# EAGLE schematic lasersupply8bit (EAGLE 5.09)
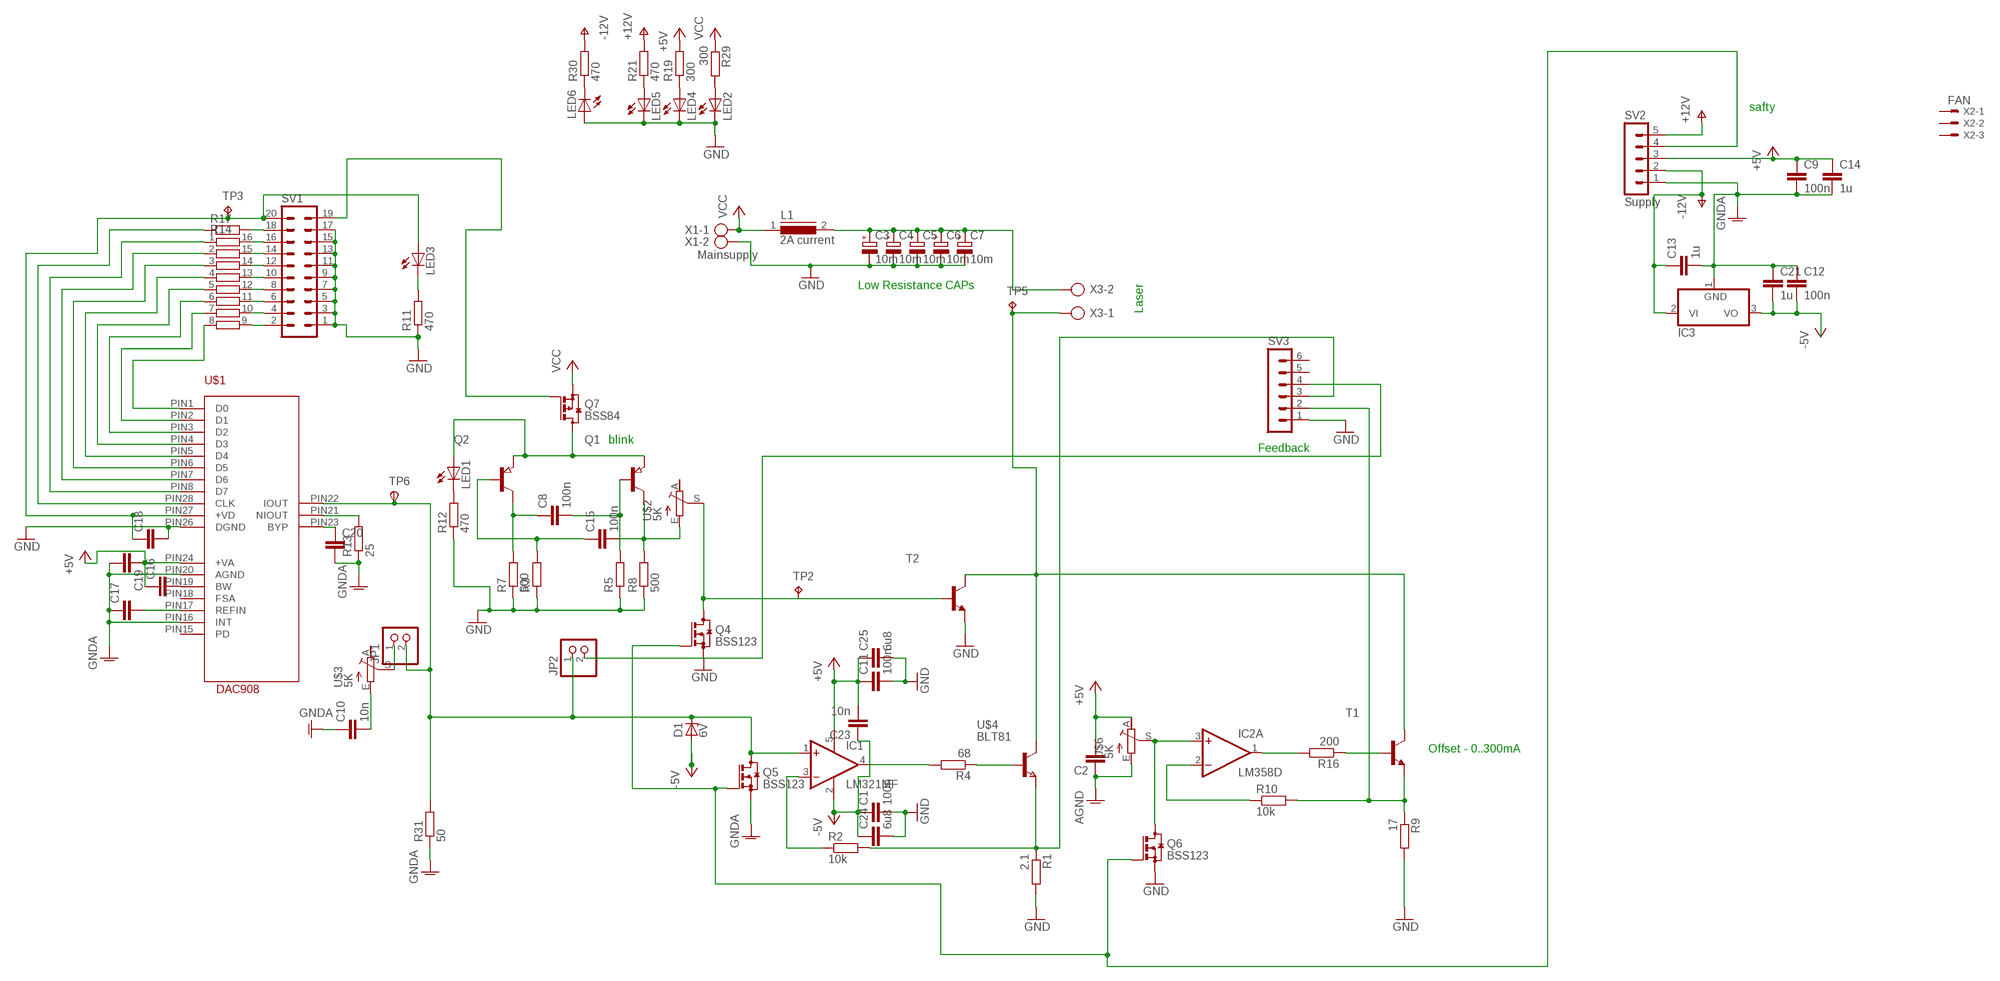
[diagram p0: schematic, sheet 1]

## Parts
C1  100n  C-EUC0805  [C0805]
C2  C-EUC0805  [C0805]
C3  10m  CPOL-EUE7.5-18  [E7,5-18]
C4  10m  CPOL-EUE7.5-18  [E7,5-18]
C5  10m  CPOL-EUE7.5-18  [E7,5-18]
C6  10m  CPOL-EUE7.5-18  [E7,5-18]
C7  10m  CPOL-EUE7.5-18  [E7,5-18]
C8  100n  C-EUC0805  [C0805]
C9  100n  C-EUC0805  [C0805]
C10  10n  C-EUC0805  [C0805]
C11  100n  C-EUC0805  [C0805]
C12  100n  C-EUC0805  [C0805]
C13  1u  C-EUC0805  [C0805]
C14  1u  C-EUC1812  [C1812]
C15  100n  C-EUC0805  [C0805]
C16  C-EUC0805  [C0805]
C17  C-EUC0805  [C0805]
C18  C-EUC0805  [C0805]
C19  C-EUC0805  [C0805]
C20  C-EUC0805  [C0805]
C21  1u  C-EUC1812  [C1812]
C23  10n  C-EUC0805  [C0805]
C24  6u8  C-EUC0805  [C0805]
C25  6u8  C-EUC0805  [C0805]
D1  6V  ZENER-DIODESMB  [SMB]
IC1  LM321MF  [SOT23-5]
IC2  LM358D  [SO08]
IC3  7905T  [TO220H]
JP1  PINHD-1X2  [1X02]
JP2  PINHD-1X2  [1X02]
L1  2A current  82114R  [82114R]
LED1  LEDCHIPLED_1206  [CHIPLED_1206]
LED2  LEDCHIPLED_1206  [CHIPLED_1206]
LED3  LEDCHIPLED_1206  [CHIPLED_1206]
LED4  LEDCHIPLED_1206  [CHIPLED_1206]
LED5  LEDCHIPLED_1206  [CHIPLED_1206]
LED6  LEDCHIPLED_1206  [CHIPLED_1206]
Q1  PNP-TRANSISTOR_SOT23  [SOT23]
Q2  PNP-TRANSISTOR_SOT23  [SOT23]
Q4  BSS123  [SOT23]
Q5  BSS123  [SOT23]
Q6  BSS123  [SOT23]
Q7  BSS84  [SOT23]
R1  2.1  R-EU_M1206  [M1206]
R2  10k  R-EU_M0805  [M0805]
R3  R-EU_M0805  [M0805]
R4  68  R-EU_M0805  [M0805]
R5  R-EU_M0805  [M0805]
R7  500  R-EU_M0805  [M0805]
R8  500  R-EU_M0805  [M0805]
R9  17  R-EU_M1206  [M1206]
R10  10k  R-EU_M0805  [M0805]
R11  470  R-EU_M0805  [M0805]
R12  470  R-EU_M0805  [M0805]
R13  25  R-EU_M0805  [M0805]
R14  2NBS16-8  [SO16]
R16  200  R-EU_M0805  [M0805]
R17  R-EU_M0805  [M0805]
R19  300  R-EU_M0805  [M0805]
R21  470  R-EU_M0805  [M0805]
R29  300  R-EU_M0805  [M0805]
R30  470  R-EU_M0805  [M0805]
R31  50  R-EU_M0805  [M0805]
SV1  ML20  [ML20]
SV2  Supply  MA05-1  [MA05-1]
SV3  MA06-1  [MA06-1]
T1  BC868-NPN-SOT89-BCE  [SOT89-BCE]
T2  BC868-NPN-SOT89-BCE  [SOT89-BCE]
TP2  TPPAD1-13  [P1-13]
TP3  TPPAD1-13  [P1-13]
TP5  TPPAD1-13  [P1-13]
TP6  TPSPAD1-13  [P1-13]
U$1  DAC908  [TSSOP-28]
U$2  5K  TRIMMER  [TRIMMER_SMD]
U$3  5K  TRIMMER  [TRIMMER_SMD]
U$4  BLT81  NXPNPNSOT223  [SOT223]
U$6  5K  TRIMMER  [TRIMMER_SMD]
X1  Mainsupply  AK500/2-H  [AK500/2-H]
X2  FAN  KK-156-3  [KK-156-3]
X3  AK500/2-H  [AK500/2-H]

## Nets
+5V: C2.2 C9.1 C11.1 C14.1 C16.1 C19.1 C23.2 C25.1 IC1.5(V+) R19.2 SV2.3 U$1.PIN24(+VA) U$6.A
-5V: C1.1 C23.1 C24.1 D1.A IC1.2(V-)
B$1: R14.8 U$1.PIN1(D0)
GND: C1.2 C3.- C4.- C5.- C6.- C7.- C11.2 C18.2 C24.2 C25.2 LED2.C LED4.C LED5.C LED6.A Q4.2(S) Q6.2(S) R1.2 R3.1 R5.1 R7.1 R8.1 R9.2 R11.1 R12.1 SV1.1 SV1.3 SV1.5 SV1.7 SV1.9 SV1.11 SV1.13 SV1.15 SV1.17 SV3.1 T2.E U$1.PIN26(DGND) X1.2
GNDA: C9.2 C10.1 C12.1 C13.2 C14.2 C17.1 C19.2 C20.2 C21.1 IC3.1(GND) Q5.2(S) R13.1 R31.1 SV2.1 U$1.PIN16(INT) U$1.PIN20(AGND)
N$1: R1.1 R2.2 SV3.3 U$4.1(E)
N$2: JP2.2 SV3.4
N$3: IC1.3(-IN) R2.1
N$4: IC1.4(OUT) R4.2
N$5: R4.1 U$4.2(B)
N$7: IC2.2(A:-IN) R10.1
N$8: LED1.A Q1.2(E) Q2.2(E) Q7.3(D)
N$9: C8.1 Q2.3(C) R7.2
N$10: D1.C IC1.1(+IN) JP1.2 JP2.1 Q5.3(D) R31.2 TP6.TP(PP) U$1.PIN22(IOUT)
N$11: IC2.1(A:OUT) R16.2
N$12: R16.1 T1.B
N$13: R9.1 R10.2 SV3.2 T1.E
N$14: IC2.3(A:+IN) Q6.3(D) U$6.S
N$17: C12.2 C21.2 IC3.3(VO)
N$19: C8.2 Q1.1(B) R5.2
N$20: T1.C T2.C TP5.TP U$4.4(C) X3.1
N$21: Q4.3(D) T2.B TP2.TP U$2.S
N$23: C15.1 Q2.1(B) R3.2
N$24: Q7.1(G) SV1.19
N$25: R14.7 U$1.PIN2(D1)
N$27: C2.1 U$6.E ; supply symbol labelled AGND
N$29: R14.6 U$1.PIN3(D2)
N$31: C15.2 Q1.3(C) R8.2 U$2.E
N$32: R14.5 U$1.PIN4(D3)
N$33: LED3.C R11.2
N$34: C3.+ C4.+ C5.+ C6.+ C7.+ L1.2 X3.2
N$35: R14.4 U$1.PIN5(D4)
N$36: R14.3 U$1.PIN6(D5)
N$37: R14.2 U$1.PIN7(D6)
N$38: R14.1 U$1.PIN8(D7)
N$39: R17.1 U$1.PIN28(CLK)
N$40: C16.2 U$1.PIN19(BW)
N$41: R14.9 SV1.2
N$42: LED2.A R29.2
N$43: C17.2 U$1.PIN17(REFIN)
N$47: R13.2 U$1.PIN21(NIOUT)
N$48: C20.1 U$1.PIN23(BYP)
N$49: R14.10 SV1.4
N$52: R14.11 SV1.6
N$53: R14.12 SV1.8
N$54: R14.13 SV1.10
N$56: R14.14 SV1.12
N$57: R14.15 SV1.14
N$59: R14.16 SV1.16
N$61: R17.2 SV1.18
N$62: JP1.1 U$3.S
N$63: C10.2 U$3.E
N$64: LED4.A R19.1
N$66: LED5.A R21.1
N$67: LED6.C R30.1
N$68: Q4.1(G) Q5.1(G) Q6.1(G) SV2.4
N$69: LED1.C R12.2
N$70: C18.1 LED3.A SV1.20 TP3.TP U$1.PIN27(+VD)
N$72: L1.1 X1.1 ; supply symbol labelled VCC
V+: R21.2 SV2.5 ; supply symbol labelled +12V
V-: C13.1 IC3.2(VI) R30.2 SV2.2 ; supply symbol labelled -12V
VCC: Q7.2(S) R29.1
Unconnected: IC2.5(B:+IN) IC2.6(B:-IN) IC2.7(B:OUT) SV3.5 SV3.6 U$1.PIN15(PD) U$1.PIN18(FSA) U$2.A U$3.A X2.1 X2.2 X2.3

## Notes on the sheet
- safty
- Low Resistance CAPs
- Laser
- blink | Feedback
- Offset - 0..300mA

## Power pins joined to a net without a drawn wire
V+: IC2.8(P:V+)
V-: IC2.4(P:V-)

## Library data of the parts
C1 C2 C8-C21 C23-C25 = rcl:C-EU: CAPACITOR, European symbol
C3-C7 = rcl:CPOL-EU: POLARIZED CAPACITOR, European symbol
D1 = diode:ZENER-DIODE: Z-Diode
IC1 = linear:LM321?*: Low Power Single Op Amp Source: http://cache.national.com/ds/LM/LM321.pdf
IC2 = linear:LM358: OP AMP also LM158; LM258; LM2904 Source: http://cache.national.com/ds/LM/LM158.pdf
IC3 = linear:79*: Negative VOLTAGE REGULATOR
JP1 JP2 = pinhead:PINHD-1X2: PIN HEADER
L1 = inductors:82114R: INDUCTOR
LED1-LED6 = led:LED: LED OSRAM: - CHIPLED LG R971, LG N971, LY N971, LG Q971, LY Q971, LO R971, LY R971 LH N974, LH R974 LS Q976, LO Q976, LY Q976 LO Q996 - Hyper CHIPLED LW Q18S LB Q993, LB Q99A, LB R99A - SideLED LS A670, LO A670, LY A670, LG A670, LP A670 LB A673, LV A673, LT A673, LW A673 LH A674 LY A675 LS A676, LA A676, LO A676, LY A676, LW A676 LS A679, LY A679, LG A679 - Hyper Micro SIDELED® LS Y876, LA Y876, LO Y876, LY Y876 LT Y87S - SmartLED LW L88C, LW L88S LB L89C, LB L89S, LG L890 LS L89K, LO L89K, LY L89K LS L896, LA L896, LO L896, LY L896 - TOPLED LS T670, LO T670, LY T670, LG T670, LP T670 LSG T670, LSP T670, LSY T670, LOP T670, LYG T670 LG T671, LOG T671, LSG T671 LB T673, LV T673, LT T673, LW T673 LH T674 LS T676, LA T676, LO T676, LY T676, LB T676, LH T676, LSB T676, LW T676 LB T67C, LV T67C, LT T67C, LS T67K, LO T67K, LY T67K, LW E67C LS E67B, LA E67B, LO E67B, LY E67B, LB E67C, LV E67C, LT E67C LW T67C LS T679, LY T679, LG T679 LS T770, LO T770, LY T770, LG T770, LP T770 LB T773, LV T773, LT T773, LW T773 LH T774 LS E675, LA E675, LY E675, LS T675 LS T776, LA T776, LO T776, LY T776, LB T776 LHGB T686 LT T68C, LB T68C - Hyper Mini TOPLED® LB M676 - Mini TOPLED Santana® LG M470 LS M47K, LO M47K, LY M47K Source: http://www.osram.convergy.de LUXEON: - LUMILED® LXK2-PW12-R00, LXK2-PW12-S00, LXK2-PW14-U00, LXK2-PW14-V00 LXK2-PM12-R00, LXK2-PM12-S00, LXK2-PM14-U00 LXK2-PE12-Q00, LXK2-PE12-R00, LXK2-PE12-S00, LXK2-PE14-T00, LXK2-PE14-U00 LXK2-PB12-K00, LXK2-PB12-L00, LXK2-PB12-M00, LXK2-PB14-N00, LXK2-PB14-P00, LXK2-PB14-Q00 LXK2-PR12-L00, LXK2-PR12-M00, LXK2-PR14-Q00, LXK2-PR14-R00 LXK2-PD12-Q00, LXK2-PD12-R00, LXK2-PD12-S00 LXK2-PH12-R00, LXK2-PH12-S00 LXK2-PL12-P00, LXK2-PL12-Q00, LXK2-PL12-R00 Source: www.luxeon.com KINGBRIGHT: KA-3528ASYC Source: www.kingbright.com
Q1 Q2 = semicon-smd-ipc:PNP-TRANSISTOR_: PNP TRANSISTOR
Q4-Q6 = transistor-small-signal:BSS123: N-CHANNEL MOS FET
Q7 = transistor-small-signal:BSS84: P-CHANNEL MOS FET
R1 R4 R9 R13 = resistor:R-EU_: RESISTOR, European symbol
R2 R3 R5 R7 R8 R10-R12 R16 R17 R19 R21 R29-R31 = rcl:R-EU_: RESISTOR, European symbol
R14 = resistor-bourns:2NBS16-8: BOURNS RESISTOR NETWORK
SV1 = con-harting-ml:ML20: HARTING
SV2 = con-lstb:MA05-1: PIN HEADER
SV3 = con-lstb:MA06-1: PIN HEADER
T1 T2 = transistor-neu-to92:*-NPN-: NPN Transistror
TP2 TP3 TP5 = testpad:TP: Test pad
TP6 = testpad:TPS: TEST PIN
U$1 = siro:DAC908
U$2 U$3 U$6 = siro:TRIMMER
U$4 = zetex:NXPNPNSOT223
X1 X3 = con-ptr500:AK500/2-H: CONNECTOR Aug. 2004 / PTR Meßtechnik: Die Bezeichnung der Serie AK505 wurde geändert. Es handelt sich hierbei um AK500 in horizontaler Ausführung.
X2 = con-molex:KK-156-3: KK 156 HEADER Source: http://www.molex.com/pdm_docs/sd/026604100_sd.pdf